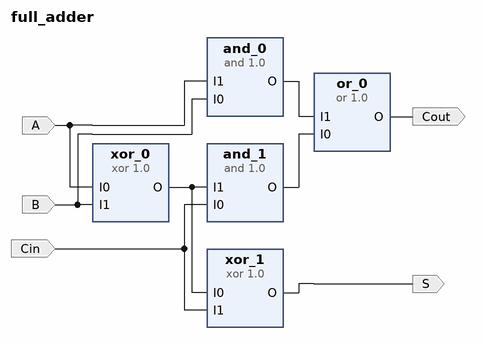
[diagram p0: block diagram of the top level]
# Vivado block design full_adder, xc7a35tcpg236-1, Vivado 2018.2.1
create_bd_design full_adder

create_bd_port -dir I A
create_bd_port -dir I B
create_bd_port -dir I Cin
create_bd_port -dir O Cout
create_bd_port -dir O S

create_bd_cell -type ip -vlnv FIT:user:and:1.0 and_0
create_bd_cell -type ip -vlnv FIT:user:xor:1.0 xor_0
create_bd_cell -type ip -vlnv FIT:user:xor:1.0 xor_1
create_bd_cell -type ip -vlnv FIT:user:or:1.0 or_0
create_bd_cell -type ip -vlnv FIT:user:and:1.0 and_1

# ---- connections ----

connect_bd_net [get_bd_ports A] [get_bd_pins xor_0/I0] [get_bd_pins and_0/I1]
connect_bd_net [get_bd_ports B] [get_bd_pins xor_0/I1] [get_bd_pins and_0/I0]
connect_bd_net [get_bd_ports Cin] [get_bd_pins xor_1/I1] [get_bd_pins and_1/I0]
connect_bd_net [get_bd_pins xor_0/O] [get_bd_pins xor_1/I0] [get_bd_pins and_1/I1]
connect_bd_net [get_bd_pins and_1/O] [get_bd_pins or_0/I0]
connect_bd_net [get_bd_pins and_0/O] [get_bd_pins or_0/I1]
connect_bd_net [get_bd_pins xor_1/O] [get_bd_ports S]
connect_bd_net [get_bd_pins or_0/O] [get_bd_ports Cout]

validate_bd_design
save_bd_design
